# EAGLE design MetalDectectorFinaltext1 (EAGLE 7.1.0)
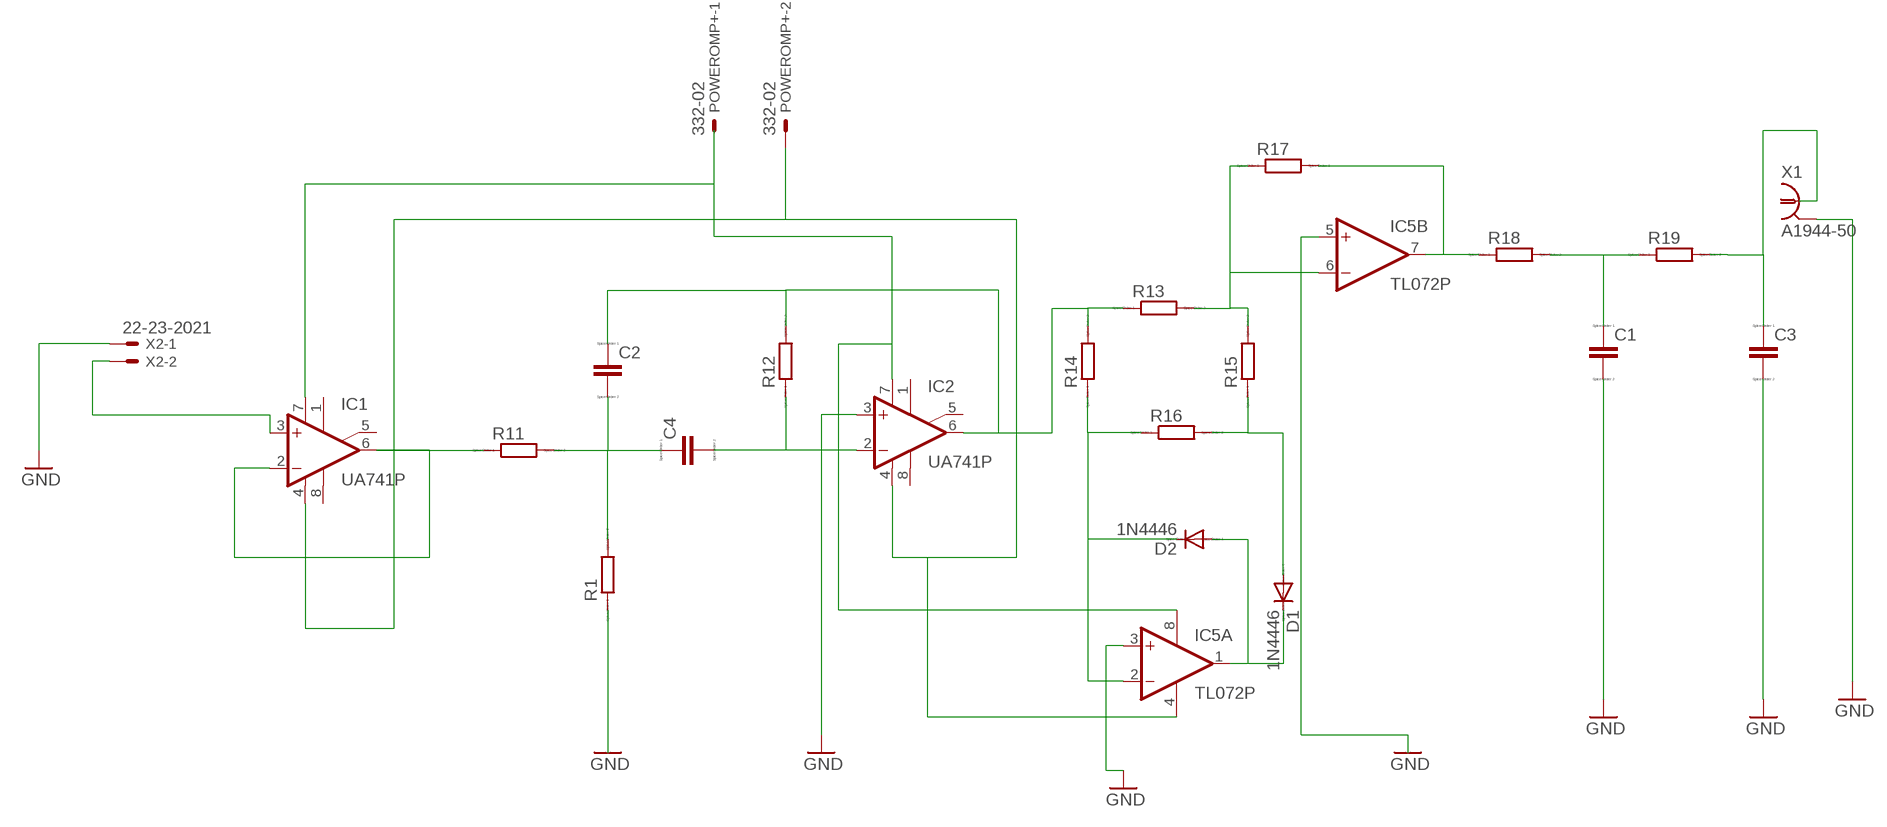
[diagram p0: schematic, sheet 1]

## Parts
C1  C-EU025-025X050  [C025-025X050]
C2  C-EU025-025X050  [C025-025X050]
C3  C-EU025-025X050  [C025-025X050]
C4  C-EU025-025X050  [C025-025X050]
D1  1N4446  [DO35-10]
D2  1N4446  [DO35-10]
IC1  UA741P  [DIL08]
IC2  UA741P  [DIL08]
IC5  TL072P  [DIL08]
POWEROMP+  332-02  [332-02]
R1  R-EU_0204_7  [0204/7]
R11  R-EU_0204_7  [0204/7]
R12  R-EU_0204_7  [0204/7]
R13  R-EU_0204_7  [0204/7]
R14  R-EU_0204_7  [0204/7]
R15  R-EU_0204_7  [0204/7]
R16  R-EU_0204_7  [0204/7]
R17  R-EU_0204_7  [0204/7]
R18  R-EU_0204_7  [0204/7]
R19  R-EU_0204_7  [0204/7]
X1  A1944-50  [A1944]
X2  22-23-2021  [22-23-2021]

## Nets
GND: C1.2 C3.2 IC2.3(+IN) IC5.3(A:+IN) IC5.5(B:+IN) X1.2 X1.3 X1.4 X1.5 X2.1
N$1: IC1.3(+IN) X2.2
N$2: IC1.2(-IN) IC1.6(OUT) R11.1
N$3: C2.2 C4.1 R1.2 R11.2
N$4: C2.1 IC2.6(OUT) R12.2 R13.1 R14.2
N$5: C4.2 IC2.2(-IN) R12.1
N$7: R1.1
N$9: IC1.4(V-) IC2.4(V-) IC5.4(P:V-) POWEROMP+.2
N$10: IC5.6(B:-IN) R13.2 R15.2 R17.1
N$12: D2.C IC5.2(A:-IN) R14.1 R16.1
N$13: D1.C D2.A IC5.1(A:OUT)
N$14: IC1.7(V+) IC2.7(V+) IC5.8(P:V+) POWEROMP+.1
N$17: IC5.7(B:OUT) R17.2 R18.1
N$18: C1.1 R18.2 R19.1
N$19: C3.1 R19.2 X1.1
N$22: D1.A R15.1 R16.2
Unconnected: IC1.1(ON1) IC1.5(ON2) IC1.8(OPT) IC2.1(ON1) IC2.5(ON2) IC2.8(OPT)

## Library data of the parts
C1-C4 = resistor:C-EU: CAPACITOR, European symbol; SPICEPREFIX: C
D1 D2 = diode:1N4446: DIODE high speed (Philips)
IC1 IC2 = linear:*741: OP AMP
IC5 = linear:TL072: OP AMP
POWEROMP+ = con-garry:332-02: 2 Pin - 2mm Dual Row Source: www.mpe-connector.de / garry_shortform_2012.pdf
R1 R11-R19 = resistor:R-EU_: RESISTOR, European symbol; SPICEPREFIX: R
X1 = con-coax:A1944-50: BNC CONNECTOR 50 Ohm distributor Buerklin 78F2475; OC_FARNELL: unknown; OC_NEWARK: unknown
X2 = con-molex:22-23-2021: .100" (2.54mm) Center Header - 2 Pin; MF: MOLEX; MPN: 22-23-2021; OC_FARNELL: 1462926; OC_NEWARK: 25C3832

## Net classes
0 default: width 0.508 mm, drill 0.305 mm, clearance 0.686 mm

## Board
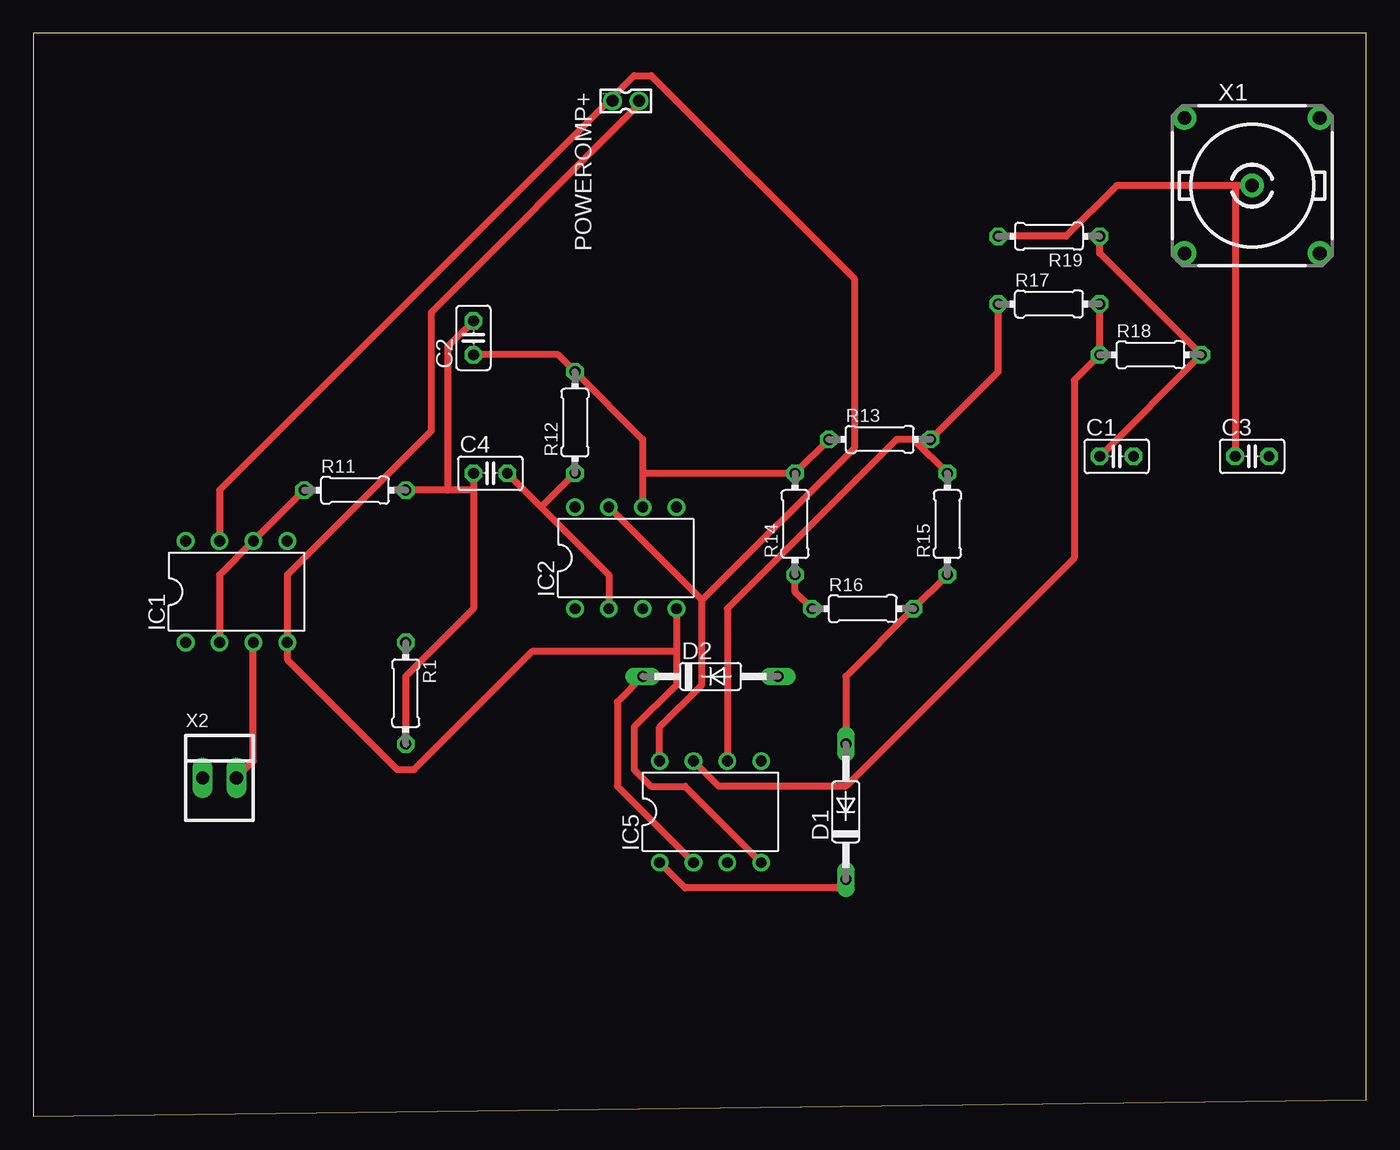
[diagram p1: board, top side]
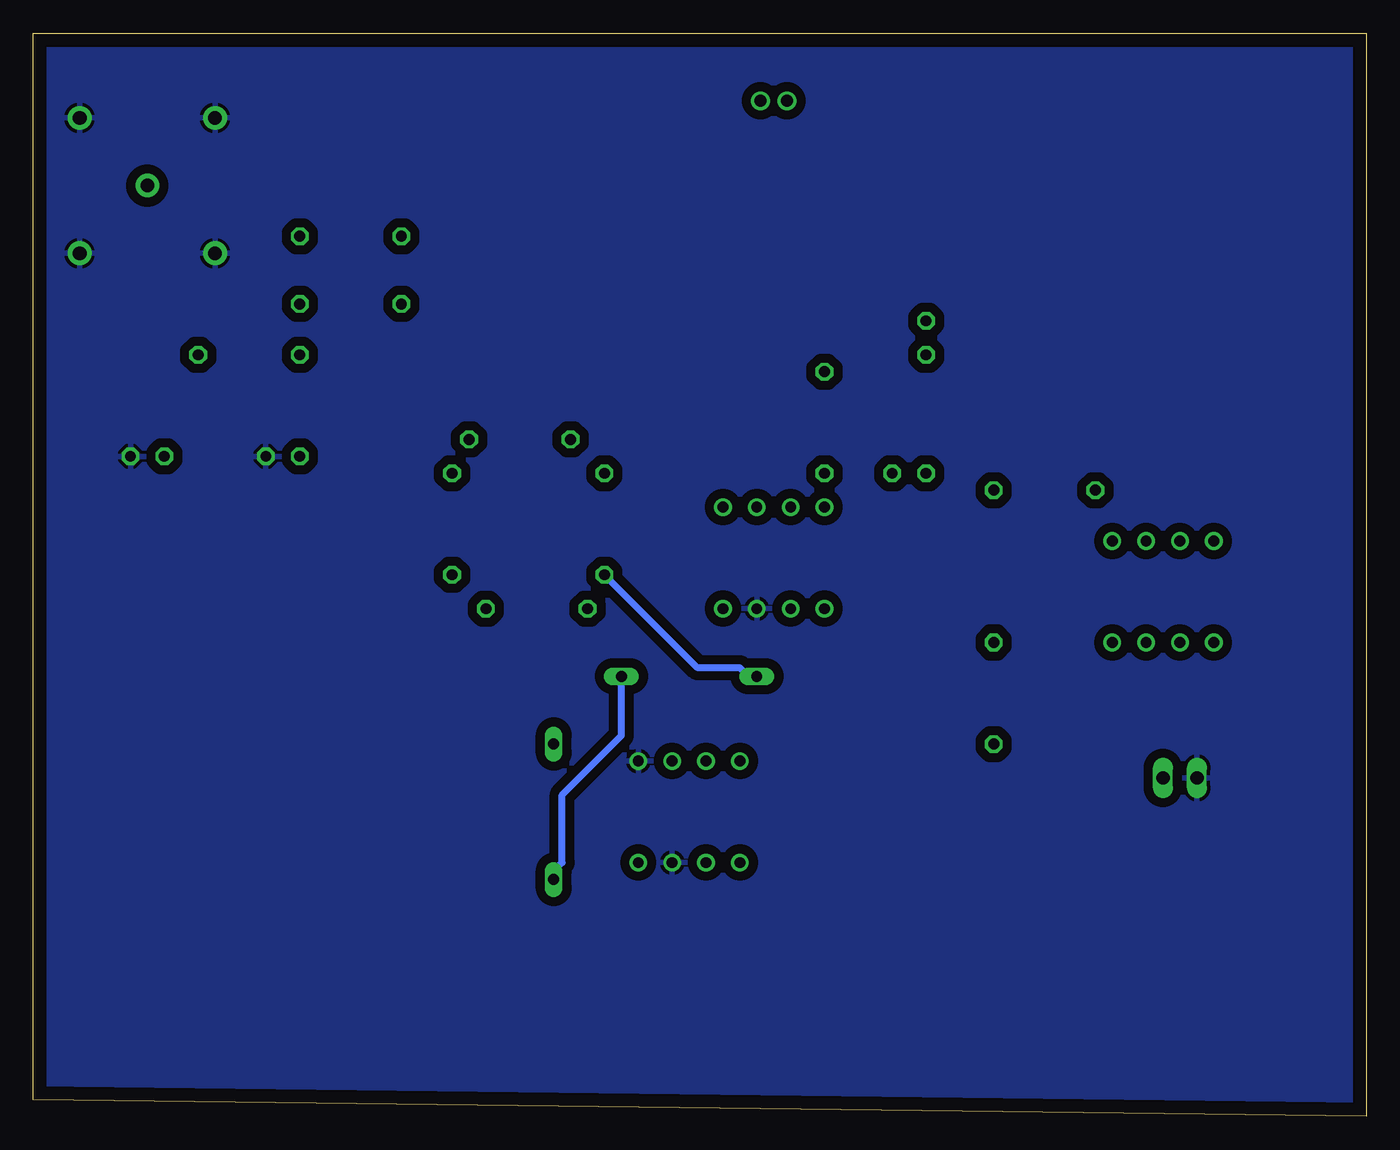
[diagram p2: board, bottom side, seen from below]

Size 100 x 81.27 mm. Coordinates in mm from the lower left corner, seen from the top.
Outline: 0,0 100,1.27 100,81.27 0,81.27 0,0
Copper layers (1*16): Top 0.035mm / dielectric 1.5mm / Bottom 0.035mm
Design rules "default *": minimum track width 10mil, minimum drill 24mil, track to track 9mil, track to pad 8mil, pad to pad 8mil, via to via 8mil, smd to smd 8mil, copper to edge 40mil, drill to drill 8mil, minimum pad ring 10mil, minimum via ring 8mil, stop-mask expansion 4mil, vias tented up to drill 0mil, thermal gap 10mil

### Footprints (pad centres in the part's own frame; a part is rotated, then mirrored left to right if it is on the bottom)
C025-025X050 = drill 0.813 octagon: 1 -1.27,0; 2 1.27,0
DO35-10 = drill 0.813 long: A 5.08,0; C -5.08,0
DIL08 = drill 0.813 pad 1.27: 1 -3.81,-3.81; 2 -1.27,-3.81; 3 1.27,-3.81; 4 3.81,-3.81; 5 3.81,3.81; 6 1.27,3.81; 7 -1.27,3.81; 8 -3.81,3.81
332-02 = drill 0.9 pad 1.27: 1 0,-1; 2 0,1
0204/7 = drill 0.813 octagon: 1 -3.81,0; 2 3.81,0
A1944 = drill 1.016 pad 1.778: 1 0,0; 2 5.08,5.08; 3 -5.08,5.08; 4 -5.08,-5.08; 5 5.08,-5.08
22-23-2021 = drill 1 long: 1 -1.27,0; 2 1.27,0

### Placement (x,y rotation side)
C1  81.28,49.53 0 top
C2  33.02,58.42 90 top
C3  91.44,49.53 0 top
C4  34.29,48.26 0 top
D1  60.96,22.86 90 top
D2  50.8,33.02 0 top
IC1  15.24,39.37 0 top
IC2  44.45,41.91 0 top
IC5  50.8,22.86 0 top
POWEROMP+  44.45,76.2 270 top
R1  27.94,31.75 270 top
R11  24.13,46.99 0 top
R12  40.64,52.07 90 top
R13  63.5,50.8 0 top
R14  57.15,44.45 90 top
R15  68.58,44.45 90 top
R16  62.23,38.1 0 top
R17  76.2,60.96 0 top
R18  83.82,57.15 0 top
R19  76.2,66.04 180 top
X1  91.44,69.85 0 top
X2  13.97,25.4 0 top

### Tracks (layer width: path | path; a pad name or v marks a point on that pad's centre or on a via)
GND
  pour Bottom: -3.81,83.82 102.87,83.82 102.87,80.01 102.87,-1.27 -3.81,-1.27 -3.81,2.54 -3.81,41.91
N$1
  Top 0.508: IC1.3 16.51,26.67 X2.2
N$2
  Top 0.508: IC1.2 13.97,40.64 IC1.6 R11.1
N$3
  Top 0.508: R1.2 27.94,33.02 33.02,38.1 33.02,46.99 | C4.1 33.02,46.99 | 33.02,46.99 31.11,46.99 | 31.11,46.99 R11.2 | C2.2 31.11,57.79 31.11,46.99
N$4
  Top 0.508: R13.1 R14.2 45.72,48.26 | 45.72,48.26 45.72,50.8 R12.2 39.37,57.15 C2.1 | 45.72,48.26 IC2.6
N$5
  Top 0.508: IC2.2 43.18,40.64 38.1,45.72 | C4.2 38.1,45.72 | 38.1,45.72 R12.1
N$9
  Top 0.508: IC5.4 48.9,24.77 46.35,24.77 45.09,26.04 45.09,29.21 48.26,32.38 48.26,34.93 | IC2.4 48.26,34.93 | POWEROMP+.2 45.72,76.2 29.84,60.33 29.84,51.44 19.05,40.64 IC1.4 19.05,34.29 27.3,26.04 28.57,26.04 37.47,34.93 48.26,34.93
N$10
  Top 0.508: IC5.6 52.07,38.1 64.77,50.8 66.04,50.8 | 66.04,50.8 R13.2 72.39,55.88 R17.1 | 66.04,50.8 R15.2
N$12
  Top 0.508: R14.1 57.15,39.37 R16.1 | IC5.2 43.81,24.77 43.81,31.11 D2.C
  Bottom 0.508: R14.1 50.16,33.66 46.99,33.66 46.35,33.02 D2.C
N$13
  Top 0.508: IC5.1 48.9,17.14 60.33,17.14 D1.C
  Bottom 0.508: D2.A 55.88,28.57 60.33,24.13 60.33,19.05 60.96,18.41 D1.C
N$14
  Top 0.508: 50.16,38.74 IC2.7 | 50.16,38.74 50.16,32.38 46.99,29.21 IC5.8 | IC1.7 13.97,46.99 43.18,76.2 | 50.16,38.74 61.59,50.17 61.59,62.87 46.35,78.1 45.09,78.1 43.18,76.2 | 43.18,76.2 POWEROMP+.1
N$17
  Top 0.508: IC5.7 51.44,24.77 60.96,24.77 78.11,41.91 78.11,55.25 R18.1 R17.2
N$18
  Top 0.508: C1.1 R18.2 80.01,64.77 R19.1
N$19
  Top 0.508: R19.2 77.47,66.04 81.28,69.85 90.17,69.85 | X1.1 90.17,69.85 | 90.17,69.85 C3.1
N$22
  Top 0.508: D1.A 60.96,33.02 R16.2 R15.1